# Altium schematic sheet 03.Schematic.SchDoc: Schematic Page
size A3; DrawnBy: My My; Revision: 1.1; SheetNumber: 3; SheetTotal: 4
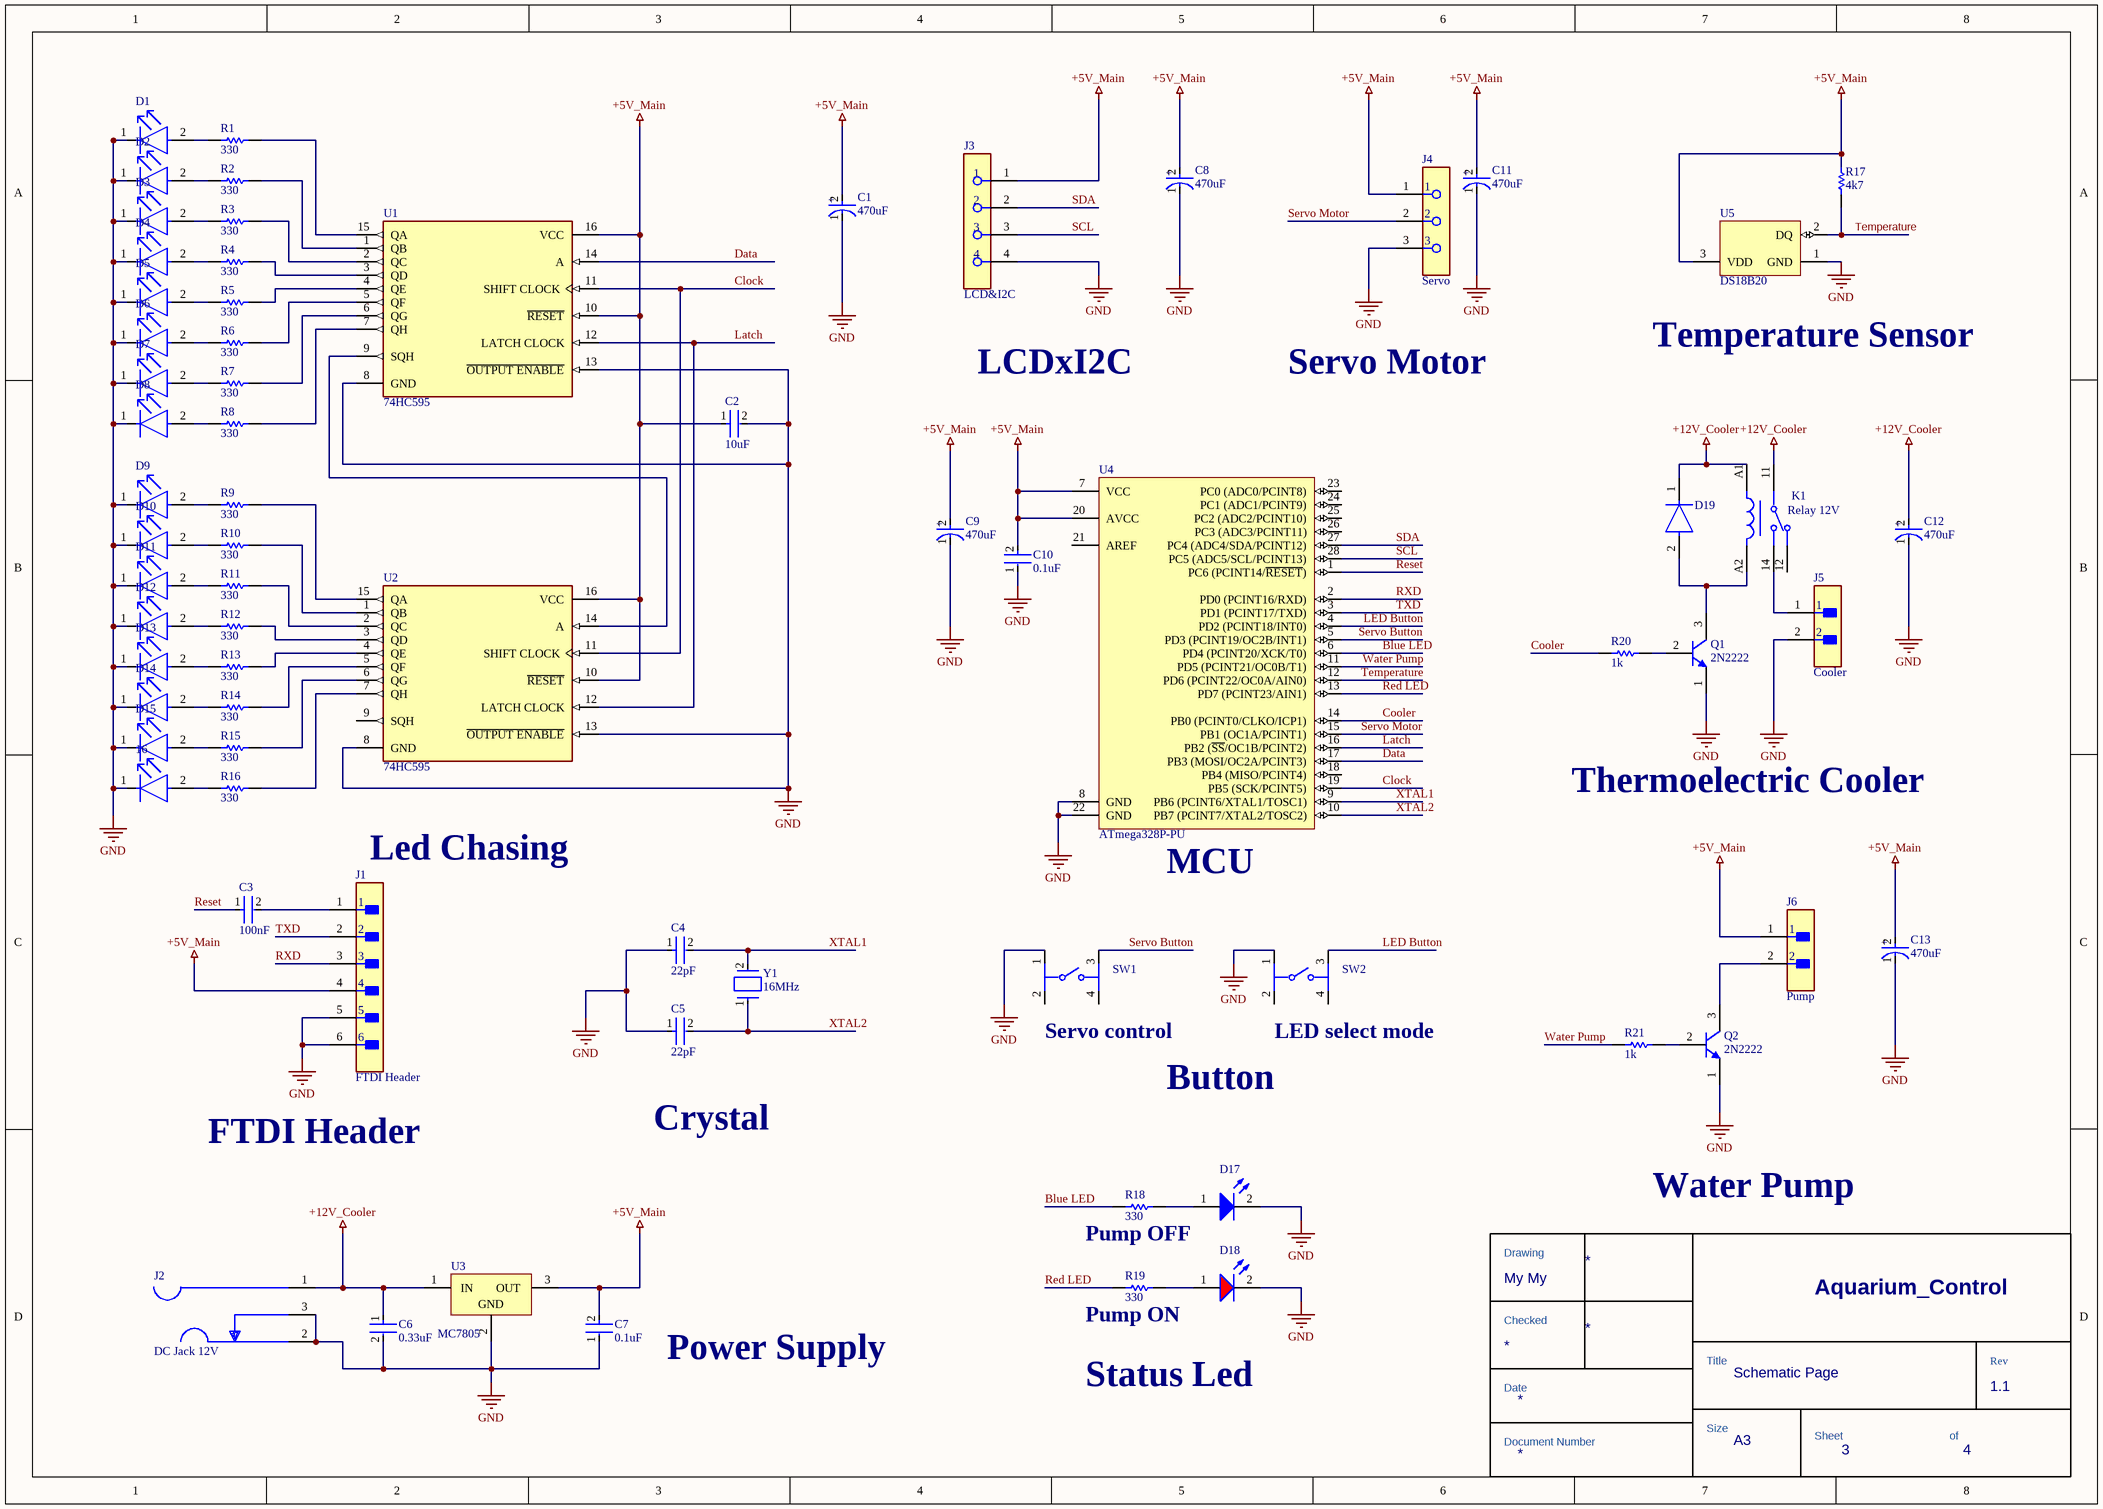
[diagram p0: 03.Schematic.SchDoc]

## Parts
16  HLMP-1719  [FP-HLMP-1719-MFG]  (value not drawn)
*  TitleBlock  (value not drawn)  (graphical)
C1  470uF  [FP-FTF-MFG]
C2  10uF  [FP-GRM188-0_1-e0_2_0_55-IPC_A]
C3  100nF  [FP-CGA3E-0_3-0_1-IPC_A]
C4  22pF  [FP-C0603C-CF-MFG]
C5  22pF  [FP-C0603C-CF-MFG]
C6  0.33uF  [FP-C0805C-DN-MFG]
C7  0.1uF  [FP-GRM15-MFG]
C8  470uF  [FP-FTF-MFG]
C9  470uF  [FP-FTF-MFG]
C10  0.1uF  [FP-GRM15-MFG]
C11  470uF  [FP-FTF-MFG]
C12  470uF  [FP-FTF-MFG]
C13  470uF  [FP-FTF-MFG]
D1  HLMP-1719  [FP-HLMP-1719-MFG]  (value not drawn)
D2  HLMP-1719  [FP-HLMP-1719-MFG]  (value not drawn)
D3  HLMP-1719  [FP-HLMP-1719-MFG]  (value not drawn)
D4  HLMP-1719  [FP-HLMP-1719-MFG]  (value not drawn)
D5  HLMP-1719  [FP-HLMP-1719-MFG]  (value not drawn)
D6  HLMP-1719  [FP-HLMP-1719-MFG]  (value not drawn)
D7  HLMP-1719  [FP-HLMP-1719-MFG]  (value not drawn)
D8  HLMP-1719  [FP-HLMP-1719-MFG]  (value not drawn)
D9  HLMP-1719  [FP-HLMP-1719-MFG]  (value not drawn)
D10  HLMP-1719  [FP-HLMP-1719-MFG]  (value not drawn)
D11  HLMP-1719  [FP-HLMP-1719-MFG]  (value not drawn)
D12  HLMP-1719  [FP-HLMP-1719-MFG]  (value not drawn)
D13  HLMP-1719  [FP-HLMP-1719-MFG]  (value not drawn)
D14  HLMP-1719  [FP-HLMP-1719-MFG]  (value not drawn)
D15  HLMP-1719  [FP-HLMP-1719-MFG]  (value not drawn)
D17  151051BS04000  [WL-TMRC_D5.9H8.7]  (value not drawn)
D18  151031SS04000  [WL-TMRC_D3.95H5.3]  (value not drawn)
D19  1N4148  [FP-017AG-MFG]  (value not drawn)
J1  FTDI Header  [FP-GBC06SBSN-M89-MFG]
J2  DC Jack 12V  [FP-L722RA-MFG]
J3  LCD&I2C  [FP-LPPB041NFFN-RC-MFG]
J4  Servo  [FP-PPTC031LGBN-RC-MFG]
J5  Cooler  [FP-PEC02SABN-MFG]
J6  Pump  [FP-PEC02SABN-MFG]
K1  RTB14005  [FP-RTB14005-MFG]  (value not drawn)
Q1  2N2222  [MLTC-TO-18-3]
Q2  2N2222  [MLTC-TO-18-3]
R1  330  [RESC1608X55X30LL15T15]
R2  330  [RESC1608X55X30LL15T15]
R3  330  [RESC1608X55X30LL15T15]
R4  330  [RESC1608X55X30LL15T15]
R5  330  [RESC1608X55X30LL15T15]
R6  330  [RESC1608X55X30LL15T15]
R7  330  [RESC1608X55X30LL15T15]
R8  330  [RESC1608X55X30LL15T15]
R9  330  [RESC1608X55X30LL15T15]
R10  330  [RESC1608X55X30LL15T15]
R11  330  [RESC1608X55X30LL15T15]
R12  330  [RESC1608X55X30LL15T15]
R13  330  [RESC1608X55X30LL15T15]
R14  330  [RESC1608X55X30LL15T15]
R15  330  [RESC1608X55X30LL15T15]
R16  330  [RESC1608X55X30LL15T15]
R17  4k7  [RESC1608X55X30LL15T15]
R18  330  [RESC1608X55X30LL15T15]
R19  330  [RESC1608X55X30LL15T15]
R20  1k  [RESC2013X60X35ML10T20]
R21  1k  [RESC2013X60X35ML10T20]
SW1  1-1825910-5  [FP-1-1825910-5-MFG]  (value not drawn)
SW2  1-1825910-5  [FP-1-1825910-5-MFG]  (value not drawn)
U1  74HC595  [FP-751B-05-MFG]
U2  74HC595  [FP-751B-05-MFG]
U3  MC7805  [ONSC-TO-220-3-221AB-01]
U4  ATmega328P-PU  [28P3]
U5  DS18B20  [Q3+1]
Y1  16MHz  [FP-XRCHA-MFG]

## Nets
+5V_Main: C1.2(A) C2.1 C7.2 C8.2(A) C9.2(A) C10.2 C11.2(A) C13.2(A) J1.4 J3.1 J4.1 J6.1 R17.2 U1.10(~{RESET}) U1.16(VCC) U2.10(~{RESET}) U2.16(VCC) U3.3(OUT) U4.7(VCC) U4.20(AVCC) U5.3(VDD)
+12V_Cooler: C6.1 C12.2(A) D19.1(C) J2.1(CENTER_PIN) K1.11 K1.A1 U3.1(IN)
GND: 16.1(C) C1.1(C) C2.2 C4.1 C5.1 C6.2 C7.1 C8.1(C) C9.1(C) C10.1 C11.1(C) C12.1(C) C13.1(C) D1.1(C) D2.1(C) D3.1(C) D4.1(C) D5.1(C) D6.1(C) D7.1(C) D8.1(C) D9.1(C) D10.1(C) D11.1(C) D12.1(C) D13.1(C) D14.1(C) D15.1(C) D17.2(K) D18.2(K) J1.5 J1.6 J2.2(SLEEVE) J2.3(SLEEVE_SHUNT) J3.4 J4.3 J5.2 Q1.1(E) Q2.1(E) SW1.1 SW2.1 U1.8(GND) U1.13(~{OUTPUT_ENABLE}) U2.8(GND) U2.13(~{OUTPUT_ENABLE}) U3.2(GND) U4.8(GND) U4.22(GND) U5.1(GND)
Blue LED: R18.1 U4.6(PD4_(PCINT20/XCK/T0))
Clock: U1.11(SHIFT_CLOCK) U2.11(SHIFT_CLOCK) U4.19(PB5_(SCK/PCINT5))
Cooler: R20.1 U4.14(PB0_(PCINT0/CLKO/ICP1))
Data: U1.14(A) U4.17(PB3_(MOSI/OC2A/PCINT3))
Latch: U1.12(LATCH_CLOCK) U2.12(LATCH_CLOCK) U4.16(PB2_(~{SS}/OC1B/PCINT2))
LED Button: SW2.3 U4.4(PD2_(PCINT18/INT0))
Red LED: R19.1 U4.13(PD7_(PCINT23/AIN1))
Reset: C3.1 U4.1(PC6_(PCINT14/~{RESET}))
RXD: J1.3 U4.2(PD0_(PCINT16/RXD))
SCL: J3.3 U4.28(PC5_(ADC5/SCL/PCINT13))
SDA: J3.2 U4.27(PC4_(ADC4/SDA/PCINT12))
Servo Button: SW1.3 U4.5(PD3_(PCINT19/OC2B/INT1))
Servo Motor: J4.2 U4.15(PB1_(OC1A/PCINT1))
Temperature: R17.1 U4.12(PD6_(PCINT22/OC0A/AIN0)) U5.2(DQ)
TXD: J1.2 U4.3(PD1_(PCINT17/TXD))
Water Pump: R21.1 U4.11(PD5_(PCINT21/OC0B/T1))
XTAL1: C4.2 U4.9(PB6_(PCINT6/XTAL1/TOSC1)) Y1.2
XTAL2: C5.2 U4.10(PB7_(PCINT7/XTAL2/TOSC2)) Y1.1
Net16_2: 16.2(A) R16.1
NetC3_2: C3.2 J1.1
NetD1_2: D1.2(A) R1.1
NetD2_2: D2.2(A) R2.1
NetD3_2: D3.2(A) R3.1
NetD4_2: D4.2(A) R4.1
NetD5_2: D5.2(A) R5.1
NetD6_2: D6.2(A) R6.1
NetD7_2: D7.2(A) R7.1
NetD8_2: D8.2(A) R8.1
NetD9_2: D9.2(A) R9.1
NetD10_2: D10.2(A) R10.1
NetD11_2: D11.2(A) R11.1
NetD12_2: D12.2(A) R12.1
NetD13_2: D13.2(A) R13.1
NetD14_2: D14.2(A) R14.1
NetD15_2: D15.2(A) R15.1
NetD17_1: D17.1(A) R18.2
NetD18_1: D18.1(A) R19.2
NetD19_2: D19.2(A) K1.A2 Q1.3(C)
NetJ5_1: J5.1 K1.14
NetJ6_2: J6.2 Q2.3(C)
NetQ1_2: Q1.2(B) R20.2
NetQ2_2: Q2.2(B) R21.2
NetR1_2: R1.2 U1.15(QA)
NetR2_2: R2.2 U1.1(QB)
NetR3_2: R3.2 U1.2(QC)
NetR4_2: R4.2 U1.3(QD)
NetR5_2: R5.2 U1.4(QE)
NetR6_2: R6.2 U1.5(QF)
NetR7_2: R7.2 U1.6(QG)
NetR8_2: R8.2 U1.7(QH)
NetR9_2: R9.2 U2.15(QA)
NetR10_2: R10.2 U2.1(QB)
NetR11_2: R11.2 U2.2(QC)
NetR12_2: R12.2 U2.3(QD)
NetR13_2: R13.2 U2.4(QE)
NetR14_2: R14.2 U2.5(QF)
NetR15_2: R15.2 U2.6(QG)
NetR16_2: R16.2 U2.7(QH)
NetU1_9: U1.9(SQH) U2.14(A)

Not connected (* = marked no-connect by the designer): K1 12; SW1 2 4; SW2 2 4; U2 9(SQH); U4 18(PB4_(MISO/PCINT4)) 21(AREF) 23(PC0_(ADC0/PCINT8)) 24(PC1_(ADC1/PCINT9)) 25(PC2_(ADC2/PCINT10)) 26(PC3_(ADC3/PCINT11))

## Notes on the sheet
- LCDxI2C
- Servo Motor
- Temperature Sensor
- (near K1) Relay 12V
- Thermoelectric Cooler
- (near J1) Led Chasing
- (near U4) MCU
- (near SW1) Servo control
- (near SW2) LED select mode
- Button
- FTDI Header
- Crystal
- (near R18) Pump OFF
- Water Pump
- (near R19) Pump ON
- Power Supply
- Status Led
- (in symbol CMP-05427-000040-1) +
- (in symbol TitleBlock) Drawing; Aquarium_Control; Checked; Title; Rev; Date; Size; Sheet; of; Document Number; A3

## Library data of the parts
16 D1-D15 = CMP-2000-06410-2: LED YELLOW DIFFUSED T-1 T/H; Manufacturer: Broadcom; Wavelength: 585nm; Led Orientation: Straight; Luminous Intensity: 2.1mcd; Forward Voltage: 1.8V; Viewing Angle: 50°; Reverse Voltage: 5V; Power Dissipation: 17.5mW; Forward Current: 2mA; Lead Free: Yes; Automotive: No; Device Class L1: Optoelectronics; Mouser Description: Standard LEDs - Through Hole Yellow Diffused 585nm 2.1mcd; Digikey Description: LED YELLOW DIFFUSED T-1 T/H; Temperature: -40°C to +100°C; Temperature Range High: +100°C; Package: 0; Category: Diode; Colour: Yellow; Device Class L2: LEDs; ComponentLink2Description: Datasheet; ComponentLink2URL: https://docs.broadcom.com/docs/AV02-1557EN; Temperature Range Low: -40°C; Device Class L3: unset; Octopart: https://octopart.com/hlmp-1719-broadcom-71130405; RoHS: TRUE; Manufacturer Part Number: HLMP-1719
* = TitleBlock: Common Title Block
C1 C8 C9 C11-C13 = CMP-05427-000040-1: CAP ALUM 470UF 20% 25V SMD; ESR (Equivalent Series Resistance): 80mR; Dielectric Material: Aluminium; Lead Diameter: 0.9mm; Ripple Current: 850mA; Leakage Current: 117.5uA; Life (Hours): 2000Hour; Lead Free: Lead Free; Height - Seated (Max): 0.413inch; Contact Plating: Tin; Voltage: 25V; Package Quantity: 500; REACH SVHC: No SVHC; Diameter: 8mm; Features: General Purpose; Voltage Rating: 25V; Radiation Hardening: No; Number of Pins: 2; Length: 10.2mm; Max Operating Temperature: 105°C; Tolerance: 20%; Lead Pitch: 3.1mm; Voltage Rating (DC): 25V; Packaging: Tape and Reel; RoHS Compliant: Yes; Series: FT; Height: 10.2mm; Capacitance: 470uF; Construction: Cylindrical; Case/Package: Radial; Mount: Surface Mount; Termination: SMD/SMT; Min Operating Temperature: -55°C; Ripple Current (AC): 850mA
C2 = CMP-2006-02792-2: Chip Multilayer Ceramic Capacitors for General Purpose, 0603, 10uF, X5R, 15%, 20%, 6.3V; Packaging: Tape and Reel; Voltage Rating (DC): 6.3V; Width: 0.031inch; Termination: SMD/SMT; Dielectric: X5R; Package Quantity: 4000; Voltage Rating: 6.3V; Capacitance: 10uF; Case/Package: 0603; Min Operating Temperature: -55°C; Voltage: 6.3V; Length: 1.6mm; Thickness: 0.035inch; Lead Free: Lead Free; Depth: 0.8mm; Case Code (Imperial): 0603; Max Operating Temperature: 85°C; Material: Ceramic; Height: 0.8mm; Tolerance: 20%; Mount: Surface Mount; REACH SVHC: No SVHC; Radiation Hardening: No; Case Code (Metric): 1608
C3 = CMP-2000-07546-2: Cap Ceramic 100nF 50V X7R 10% Pad SMD 0603 +125°C Automotive T/R; Weight: 7.1E-05oz; Composition: Ceramic; Max Operating Temperature: 125°C; Termination: SMD/SMT; Dielectric: X7R; Length: 1.6mm; Package Quantity: 1; REACH SVHC: No SVHC; Lead Free: Lead Free; Case Code (Metric): 1608; Min Operating Temperature: -55°C; Packaging: Tape and Reel; Tolerance: 10%; Voltage Rating: 50V; Case Code (Imperial): 0603; Capacitance: 100nF; Case/Package: 0603; Voltage Rating (DC): 50V; Depth: 0.8mm; Radiation Hardening: No; Ratings: AEC-Q200; Mount: Surface Mount; Voltage: 50V; Thickness: 0.035inch; Width: 0.8mm; Height: 0.8mm
C4 C5 = CMP-2006-03119-3: Cap Ceramic 22pF 50V C0G 5% SMD 0603 125°C Paper T/R; Manufacturer Part Number: C0603C220J5GACTU; Manufacturer: KEMET; Temperature Coefficient: 30ppm/°C; Automotive Grade: Grade 1; Tolerance: 0.05; RoHS: TRUE; Temperature Characteristic: C0G; Capacitance: 22 pF; Device Class L3: Ceramic Capacitors; Digikey Description: Cap Ceramic 22pF 50V C0G 5% SMD 0603 125°C Paper T/R; ComponentLink2URL: https://api.kemet.com/component-edge/download/datasheet/C0603C100J5GACAUTO.pdf; ComponentLink2Description: Datasheet; Automotive: Yes; Temperature: -55°C to +125°C; Temperature Range High: +125°C; Package: C0603C-CF; Device Class L1: Passive Components; Device Class L2: Capacitors; Lead Free: Yes; Value: 22 pF; Category: Cap; Mouser Description: Cap Ceramic 22pF 50V C0G 5% SMD 0603 125°C Paper T/R; Voltage Rating: 50 V; Height: 0.87mm; Material: Ceramic; Temperature Range Low: -55°C; Octopart: https://octopart.com/c0603c220j5gactu-kemet-98525
C6 = CMP-1036-04607-3: CAP CER 0.33UF 50V X7R 0805; Manufacturer Part Number: C0805C334K5RACTU; Manufacturer: KEMET; Temperature Coefficient: 30ppm/°C; Value: 0.33 μF; Material: Ceramic; Tolerance: 0.1; Temperature: -55°C to +125°C; Temperature Range Low: -55°C; Voltage Rating: 50 V; Lead Free: Yes; Mouser Description: Multilayer Ceramic Capacitors MLCC - SMD/SMT 50volts 0.33uF 10% X7R; Automotive: No; Package: C0805C-DN; Temperature Characteristic: X7R; Capacitance: 0.33 μF; Digikey Description: CAP CER 0.33UF 50V X7R 0805; Device Class L3: Ceramic Capacitors; Temperature Range High: +125°C; Category: Cap; Ipc Land Pattern Name: CAPC200125X78; ComponentLink2URL: https://content.kemet.com/datasheets/KEM_C1003_C0G_SMD.pdf; ComponentLink2Description: Datasheet; RoHS: TRUE; Device Class L1: Passive Components; Height: 0.88mm; Octopart: https://octopart.com/c0805c334k5ractu-kemet-10475704; Device Class L2: Capacitors
C7 C10 = CMP-2100-03641-2: CAP CER 0.1UF 16V X7R 0402; Manufacturer Part Number: GRM155R71C104KA88D; Manufacturer: Murata; Standoff Height: 0mm; Tolerance: 10%; Voltage Rating: 16Vdc; Material: Ceramic; Capacitance: 0.10μF; Value: 0.10μF; RoHS: TRUE; Temperature Characteristic: X7R; Octopart: https://octopart.com/grm155r71c104ka88d-murata-196880; Digikey Description: CAP CER 0.1UF 16V X7R 0402; Device Class L3: Ceramic Capacitors; Height: 0.55mm; ComponentLink2Description: Datasheet; Temperature Range Low: -55°C; Ipc Land Pattern Name: CAPC10050X219; ComponentLink2URL: https://search.murata.co.jp/Ceramy/image/img/A01X/G101/ENG/GRM155R71H471KA01-01A.pdf; Device Class L1: Passive Components; Lead Free: yes; Category: Cap; Package: GRM15; Temperature: -55°C to +125°C; Device Class L2: Capacitors; Temperature Range High: +125°C; Mouser Description: 0402 0.1 uF 16V ±10 % Tolerance X7R SMT Multilayer Ceramic Capacitor
D17 = CMP-1488-00009-2: NexarPartId: 29717812; Test Current: 20mA; Forward Voltage: 3.2V; Wavelength: 470nm; Lens Size: 5mm; Lens Style: Circular, Diffused, Round; Forward Current: 100mA; Peak Wavelength: 465nm; Viewing Angle: 40°; Luminous Intensity: 500mcd; Max Reverse Voltage (DC): 5V; Color: Blue; Case/Package: Radial; Width: 5mm; Mount: Through Hole; Min Operating Temperature: -40°C; Length: 5mm; Height: 8.6mm; Max Operating Temperature: 85°C; Packaging: Bulk; RoHS: Compliant; REACH SVHC: Unknown; Dominant Wavelength: 470nm
D18 = CMP-1488-00005-2: NexarPartId: 29717802; Lens Size: 3mm; Wavelength: 635nm; Luminous Intensity: 160mcd; Peak Wavelength: 640nm; Forward Voltage: 2V; Color: Red; Max Reverse Voltage (DC): 5V; Viewing Angle: 40°; Forward Current: 100mA; Lens Style: Circular, Diffused, Round; Test Current: 20mA; Packaging: Bulk; RoHS: Compliant; Height: 5.3mm; Mount: Through Hole; Max Operating Temperature: 85°C; Length: 3mm; Dominant Wavelength: 635nm; REACH SVHC: Unknown; Case/Package: Radial; Min Operating Temperature: -40°C; Width: 3mm
D19 = CMP-07163-000046-1: DIODE GEN PURP 100V 200MA DO35; Forward Voltage: 1V; Max Power Dissipation: 500mW; Max Reverse Current: 5uA; Forward Current: 300mA; Current: 4A; Reverse Recovery Time: 4ns; Element Configuration: Single; Outside Diameter: 1.85mm; Capacitance: 4pF; Polarity: Standard; Max Forward Surge Current (Ifsm): 1A; Reverse Voltage: 100V; Output Current: 200mA; Average Rectified Current: 200mA; Diameter: 1.91mm; Max Repetitive Reverse Voltage (Vrrm): 100V; Current Rating: 200mA; Case/Package: DO-35; Lead Free: Lead Free; Number of Pins: 2; Recovery Time: 4ns; Packaging: Bulk; Contact Plating: Tin; Voltage: 100V; Mount: Through Hole; Max Surge Current: 4A; Package Quantity: 2000; Width: 1.91mm; Max Reverse Voltage (DC): 100V; Length: 4.56mm; Radiation Hardening: No; Power Dissipation: 500mW; Voltage Rating (DC): 100V; Peak Non-Repetitive Surge Current: 4A; REACH SVHC: No SVHC; Height: 4.56mm; Max Operating Temperature: 175°C; Series: -; Weight: 0.01lb; Min Operating Temperature: -65°C
J1 = CMP-25680-000080-1: CONN HEADER SMD R/A 6POS 2.54MM; Number of Contacts: 6; Gender: Male; Connector Type: Male Pin; Pitch: 0.1inch; Number of Rows: 1; Termination: Solder; Contact Type: Male Pin; Number of Positions: 6; Lead Free: Lead Free; Width: 2.54mm; Housing Material: Plastic; Height: 3.56mm; Mount: Surface Mount; Length: 15.2mm; Color: Black; Contact Mating Length: 0.23inch; Contact Material: Bronze; Contact Plating: Gold; Housing Color: Black; Package Quantity: 1; Packaging: Bulk; RoHS Compliant: Yes
J2 = CMP-47995-000001-1: CONN POWER JACK 2.1MM ID SOLDER; Manufacturer: Switchcraft; Manufacturer Part Number: L722RA; Conn Orientation: Right Angle; Number Of Contacts: 3; Conn Gender: Male; Current Rating: 5A; Pitch: 3.302mm; Shielding: true; RoHS: TRUE; Height: 0.57inch; Device Class L1: Connectors; Category: Conn; ComponentLink2URL: http://www.switchcraft.com/Drawings/7__RA_SERIES-7__RAH_SERIES_CD.PDF; Octopart: https://octopart.com/l722ra-switchcraft-28281; Package: L722RA; Device Class L3: unset; Automotive: No; Voltage Rating: 12V; Mouser Description: DC Power Connectors R/A PC TERMINALS LONG BUSHING; Digikey Description: CONN POWER JACK 2.1MM ID SOLDER; Device Class L2: Power Connectors; Contact Material: Silver; ComponentLink2Description: Datasheet; Lead Free: Yes
J3 = CMP-25680-000035-1: CONN HDR 4POS 0.05 GOLD PCB; Pitch: 0.05inch; Number of Positions: 4; Connector Type: Header; Contact Type: Female Socket; Lead Free: Lead Free; Mount: Through Hole; RoHS Compliant: Yes; Package Quantity: 1; Termination: Solder; Contact Plating: Gold; Number of Rows: 1; Packaging: Bulk
J4 = CMP-00595-00270343-2: PPTC031LGBN-RC Fixed Resistor, Metal Film, 1W, 10000ohm, 350V, 5% +/-Tol, 250ppm/Cel, Through Hole Mount; NexarPartId: 270343; Current Rating: 3A; Gender: Female; Pitch: 2.54mm; Connector Type: Header, Socket; Number of Positions: 3; Max Operating Temperature: 105°C; Lead Free: Lead Free; Contact Plating: Tin; Contact Material: Bronze; Number of Rows: 1; Termination: Solder; Color: Black; Length: 8.12mm; Housing Material: Plastic; Min Operating Temperature: -40°C; Packaging: Bulk; Width: 8.5mm; Mount: Through Hole; Housing Color: Black; Height: 2.4mm; RoHS: Compliant
J5 J6 = CMP-25680-000076-1: CONN HEADER VERT 2POS 2.54MM; Pitch: 0.1inch; Gender: Male; Number of Contacts: 2; Connector Type: Male Pin; Housing Color: Black; Insulation Color: Black; Housing Material: Plastic; Contact Type: Male Pin; Series: -; Flammability Rating: UL94 V-0; Max Operating Temperature: 125°C; Fastening Type: Pull; Contact Finish - Mating: TIN; Insulation Material: PBT; Contact Plating: Tin; Lead Free: Lead Free; Mount: Through Hole; Termination: Solder; Width: 2.54mm; Contact Material: Bronze; Color: Black; Number of Rows: 1; Packaging: Bulk; Length: 5.08mm; Min Operating Temperature: -65°C; Contact Shape: Square; Contact Mating Length: 0.23inch; RoHS Compliant: Yes; Package Quantity: 1; Height: 2.54mm; Number of Positions: 2
K1 = CMP-03395-000207-1: RELAY GEN PURPOSE SPDT 12A 5V; Relay Type: General Purpose; Dropout Voltage: 500mV; Coil Power: 500mW; Max Voltage Rating (AC): 400V; Contact Voltage Rating (AC): 250V; Coil Current: 80mA; Coil Type: Non-Latching; Release Time: 6ms; Application(s): POWER; Coil Resistance: 62R; Operate Time: 8ms; Contact Material: Silver; Length: 29mm; Number of Pins: 5; RoHS Compliant: Yes; Height: 15.7mm; Package Quantity: 500; Max Operating Temperature: 85°C; Contact Current Rating: 12A; Depth: 12.7mm; Radiation Hardening: No; Weight: 0.494oz; Lead Free: Lead Free; Packaging: Carton; Width: 12.7mm; Mount: Socket; Series: RT1, SCHRACK; ELV: Compliant; Termination: Plug; Throw Configuration: SPDT; Min Operating Temperature: -40°C; Coil Voltage (DC): 5V
Q1 Q2 = CMP-2000-05237-1: Low Power Bipolar NPN Transistor, 30 V, -65 to 200 degC, 3-Pin TO-18, RoHS, Bulk; Manufacturer: Multicomp; Pin Configuration: a; No. of Pins: 3; No. of Transistors: 1; Collector Emitter Voltage Vces: 400mV; Current Ic Continuous a Max: 800mA; Power Dissipation Pd: 500mW; Collector Emitter Voltage V(br)ceo: 30V; Gain Bandwidth ft Typ: 250MHz; Voltage Vcbo: 60V; DC Current Gain hFE: 100; Full Power Rating Temperature: 25degC; Current Ic @ Vce Sat: 150mA; SVHC: NoSVHC(19-Dec-2012); Package Reference: TO-18-3; Package Description: 3-Pin Transistor Outline Package (TO-18), Dia 5.54 mm, Pitch Pitch 1.485mm; Datasheet URL: http://www.farnell.com/datasheets/1662272.pdf; Transistor Case Style: TO-18; Continuous Collector Current Ic Max: 800mA; Manufacturer URL: http://uk.farnell.com/b/multicomp; DC Collector Current: 800mA; Hfe Min: 100; Transistor Polarity: NPN; Power Dissipation Ptot Max: 500mW; Package / Case: TO-18; Datasheet Version: Rev. 1.1, 05/2012; Gain Bandwidth ft Min: 250MHz; Current Ic hFE: 150mA
R1-R19 = CMP-2000-00435-2: Chip Resistor, 330 Ohm, +/- 1%, 0.1 W, -55 to 155 degC, 0603 (1608 Metric), RoHS, Tape and Reel; Gender: Male; Mating Cycles: 10000; Current Rating: 500 mA; Voltage Rating: 10 V; REACH SVHC: No SVHC; PackageDescription: 2-Pin Surface Mount Device, Body 1.6 x 0.85 mm; Contact Finish: Gold; Pins: 8; ComponentLink1Description: Manufacturer URL; Packaging: Tape and Reel; Max Operating Temperature: 85 degC; Contact Material: Copper; Height: 1.45 mm; Width: 1.45 mm; DatasheetVersion: Apr-15; Package Quantity: 1500; Contact Plating: Gold; PackageReference: 0603; Mount: Surface Mount; Lead Pitch: 1.1 mm; Min Operating Temperature: -25 degC; ComponentLink1URL: http://www.panasonic.com/; ComponentLink2URL: http://industrial.panasonic.com/cdbs/www-data/pdf/RDA0000/AOA0000C86.pdf; Length: 13.7 mm; ComponentLink2Description: Datasheet; RoHSCompliant: true
R20 R21 = CMP-2100-03671-1: Chip Resistor, 1 KOhm, +/- 1%, 125 mW, -55 to 155 degC, 0805 (2012 Metric), RoHS, Tape and Reel; Manufacturer: Yageo; Temperature Coefficient: 100ppm/degreesC; Voltage Rating (DC): 150V; Max Power Dissipation: 125mW; Resistance: 1KOhm; Number of Pins: 2; Number of Terminations: 2; Datasheet URL: http://www.yageo.com/NewPortal/yageodocoutput?fileName=/pdf/R-Chip/PYu-RC_Group_51_RoHS_L_5.pdf; Length: 0.079inch; Package Description: 2-Pin Surface Mounted Device, Body 2 x 1.25 mm; Depth: 1.25mm; Height: 0.024inch; Military Standard: Not; Case/Package: 0805; Package Reference: 0805; RoHSCompliant: true; Lead Free: LeadFree; Packaging: TapeandReel; Package Quantity: 1; Datasheet Version: Rev. 5, 10/2016; Tolerance: 1%; Min Operating Temperature: -55degC; Voltage Rating: 150V; Composition: ThickFilm; Case Code (Imperial): 0805; Power Rating: 125mW; Width: 0.049inch; Case Code (Metric): 2012; Manufacturer URL: http://www.yageo.com/; Max Operating Temperature: 155degC; REACH SVHC: Unknown; Termination: SMD/SMT
SW1 SW2 = CMP-03407-000006-1: SWITCH TACTILE SPST-NO 0.05A 24V; Contact Current Rating: 50mA; Actuator Length: 5.9mm; Switch Travel: 0.25mm; Electrical Life: 100000Cycles; Operating Force: 2.55N; Actuator Color: Red; Switch Function: Off-Mom; Throw Configuration: SPST; Contact Resistance: 100mR; Actuator Material: PBT; Actuator Type: Standard; Illumination Type: Non-Illuminated; Package Quantity: 750; Contact Plating: Silver; Length: 5.99mm; Contact Material: Brass; Type: Switch; Max Operating Temperature: 85°C; Orientation: Straight; Mechanical Life: 100000Cycles; Max Voltage Rating (DC): 24V; Series: FSMJ, Alcoswitch; Max Current Rating: 50mA; Radiation Hardening: No; Min Operating Temperature: -35°C; RoHS Compliant: Yes; Mount: Through Hole; Voltage Rating (DC): 24V; Termination: PC Pins; Packaging: Loose Piece
U1 U2 = CMP-07115-000002-1: IC SHIFT REGISTR 8BIT 3ST 16SOIC; Manufacturer Part Number: MC74HC595ADR2G; Manufacturer: On Semiconductor; Number Of Inputs: 1; Frequency: 35MHz; Logic Function Desc: Serial to Parallel; Quiescent Current: 40uA; Standoff Height: 0.1mm; Max Supply Voltage: 6V; Min Supply Voltage: 2V; Number Of Outputs: 8; Height: 1.75mm; Lead Free: Yes; Device Class L3: Shift Registers; Device Class L1: Integrated Circuits (ICs); ComponentLink2URL: https://www.onsemi.com/pub/Collateral/MC74HC595A-D.PDF; Category: IC; Device Class L2: Logic ICs; RoHS: TRUE; Footprint Url: https://www.onsemi.com/pub/Collateral/751B-05.PDF; Ambient Temperature Range Low: -55°C; Automotive: No; ComponentLink2Description: Datasheet; Temperature Range High: +125°C; Ambient Temperature Range High: +125°C; Ipc Land Pattern Name: SOIC127P600X155-16; Nominal Supply Current: 40uA; Mouser Description: Counter Shift Registers 8-Bit 3 State Shift; Octopart: https://octopart.com/mc74hc595adr2g-on+semiconductor-112155; Temperature Range Low: -55°C; Package: 751B-05; Temperature: -55°C to +125°C; Digikey Description: IC SHIFT REGISTR 8BIT 3ST 16SOIC; Number Of Circuits: 1
U3 = CMP-2000-04928-1: Positive Voltage Regulator, 1 A, 5 V, 0 to 125 degC, 3-Pin TO-220, RoHS, Tube; Manufacturer: ON Semiconductor; Resistance, Thermal, Junction to Case: 5degC/W; Voltage, Supply: 35V; Regulator Function: Standard; Temperature, Operating, Maximum: +125degC; Load Regulation: 25mV; Regulator Type: PositiveVoltageOut; Current, Output, Maximum: 1A; Regulation, Load: 1.3mV; Number of Outputs: 1; Temperature, Operating, Range: 0to+125degC; Regulation, Line: 0.5mV; Line Regulation: 20mV; Voltage, Input Range: Maximumof35V; Output Type: Fixed; Current, Quiescent Supply: 6.5mA; Dropout Voltage: 2V; Temperature, Operating, Minimum: 0degC; Package Version: Rev. A, 11/2010; Current, Supply: 3.2mA; Voltage, Output: 5V; Voltage, Noise: 10μV/V; Package Type: TO-220; Voltage, Input, High Level: 35V; Datasheet URL: http://www.onsemi.com/pub_link/Collateral/MC7800-D.PDF; Dimensions: 10.28x4.82x15.75mm; Width: 4.82mm; Type: VoltageRegulator; Mounting Type: ThroughHole; Polarity: Positive; Datasheet Version: Rev. 27, 11/2014; Height: 15.75mm; Dropout Voltage Measurement Current: 1A; Package Description: 3-Pin Flange Mount, Vertical Straight Lead, Body 9.97 x 4.445 mm, Pitch 2.54 mm; Manufacturer URL: http://www.onsemi.com/; Voltage, Dropout: 2V; Length: 10.28mm; Number of Pins: 3; Package Reference: TO-220-3-221AB-01
U4 = CMP-0095-00013-2: 8-bit AVR Microcontroller, 32KB Flash, 1KB EEPROM, 2KB SRAM, 28-pin PDIP, Industrial Grade (-40°C to 85°C); RevisionNote: DatasheetVersion updated. URLs added.; PackageVersion: revB, Sep-2001; PackageDescription: 28-lead (0.300"/7.62mm Wide) Plastic Dual Inline Package (PDIP); DatasheetVersion: revD, May-2011; ComponentLink1Description: Manufacturer URL; ComponentLink1URL: http://www.atmel.com/; PackageReference: 28P3; ComponentLink2Description: ATmega48A/48PA/88A/88PA/168A/168PA/328/328P Datasheet; ComponentLink3URL: http://www.atmel.com/dyn/resources/prod_documents/8271S.pdf; ComponentLink2URL: http://www.atmel.com/dyn/resources/prod_documents/8271.pdf; ComponentLink3Description: ATmega48A/48PA/88A/88PA/168A/168PA/328/328P Summary
U5 = CMP-0253-00003-1: Programmable Resolution Digital Thermometer, 1-Wire Interface, ±0.5°C Accuracy, 3-Pin TO92, -55°C to +125°C, Pb-Free; ComponentLink2URL: http://datasheets.maxim-ic.com/en/ds/DS18B20.pdf; PackageReference: Q3+1; ComponentLink1Description: Manufacturer URL; PackageDescription: TO-92 Package, Body Dia. 4.7mm; Leads 0.51 x 0.51 mm (max), Pb-Free; DatasheetVersion: 2007; Code_JEDEC: TO-226-AA; ComponentLink1URL: http://www.maxim-ic.com; PackageVersion: revB, 2009; ComponentLink2Description: Datasheet
Y1 = CMP-06054-000011-1: CRYSTAL 16.0000MHZ 8PF SMD; Frequency Stability: 100ppm; ESR (Equivalent Series Resistance): 100R; Frequency: 16MHz; Lead Pitch: 1.45mm; Packaging: Tape and Reel; Ratings: AEC-Q200; Weight: 0.000459oz; Width: 0.079inch; Load Capacitance: 8pF; Termination: SMD/SMT; Length: 0.098inch; Package Quantity: 3000; Frequency Tolerance: 100ppm; Max Operating Temperature: 125°C; Case/Package: SMD/SMT; Min Operating Temperature: -40°C; Height: 0.031inch; Mount: Surface Mount; Tolerance: 100ppm